# Altium project Analog-PCB_Project.PrjPcb
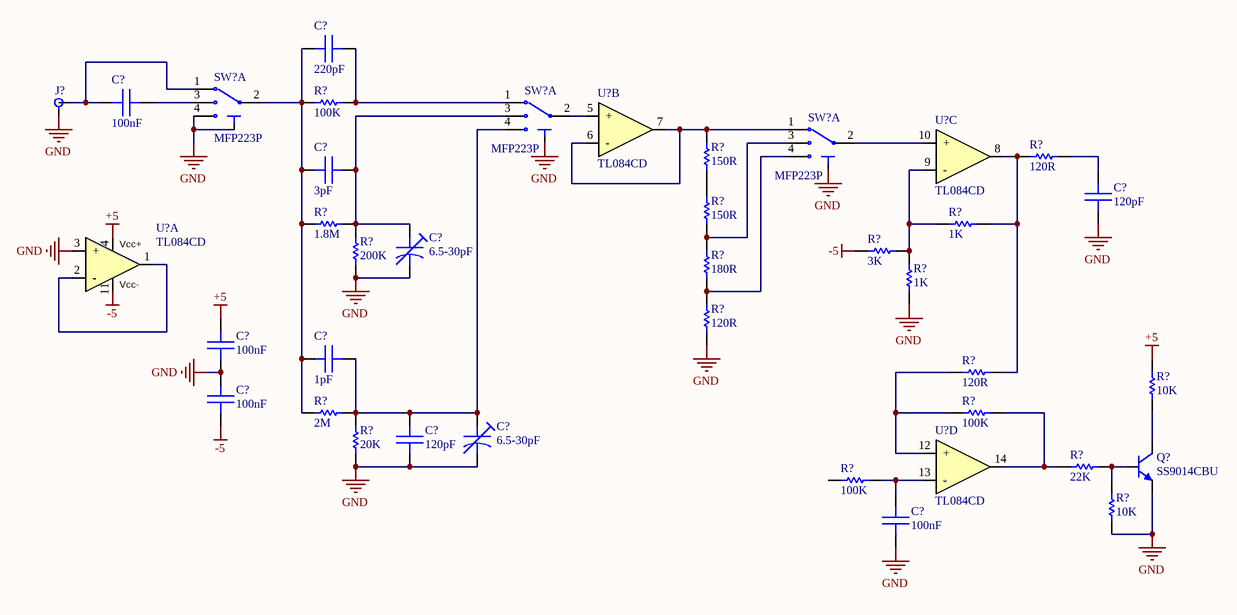
[diagram p0: Sheet.SchDoc]
1 sheet, 39 parts. Net scope: global (net labels, ports and power ports of the same name join across sheets).
Board file: PCB.PcbDoc

## Sheet Sheet.SchDoc: IOElectro LAOS - Analog
size A4; Author: -; CompanyName: IOElectro; DrawnBy: Esmaeill M; Engineer: -; Organization: IOElectro; Address1: Bushehr,Iran; Address2: www.ioelectro.ir; DocumentNumber: 1; Revision: v0.1; SheetNumber: 1; SheetTotal: 1; ProjectNumber: 1013; Note: Analog module

### Parts
(Parts that share a designator on the sheet are numbered #1, #2 ... from top to bottom, then left to right.)
C?#1  220pF  [C-BP-Ceramic-DIP]
C?#2  100nF  [C-BP-Ceramic-DIP]
C?#3  3pF  [C-BP-Ceramic-DIP]
C?#4  120pF  [C-BP-Ceramic-DIP]
C?#5  6.5-30pF  [C-TR-DIP_5mm]
C?#6  100nF  [C-BP-Ceramic-DIP]
C?#7  1pF  [C-BP-Ceramic-DIP]
C?#8  100nF  [C-BP-Ceramic-DIP]
C?#9  120pF  [C-BP-Ceramic-DIP]
C?#10  6.5-30pF  [C-TR-DIP_5mm]
C?#11  100nF  [C-BP-Ceramic-DIP]
J?  Mini BNC  [BNC-Mini_No3D]  (value not drawn)
Q?  SS9014CBU  [TO-92]
R?#1  100K  [R-1/4W-DIP-Blue]
R?#2  120R  [R-1/4W-DIP-Blue]
R?#3  150R  [R-1/4W-DIP-Blue]
R?#4  1.8M  [R-1/4W-DIP-Blue]
R?#5  150R  [R-1/4W-DIP-Blue]
R?#6  1K  [R-1/4W-DIP-Blue]
R?#7  3K  [R-1/4W-DIP-Blue]
R?#8  200K  [R-1/4W-DIP-Blue]
R?#9  1K  [R-1/4W-DIP-Blue]
R?#10  180R  [R-1/4W-DIP-Blue]
R?#11  120R  [R-1/4W-DIP-Blue]
R?#12  120R  [R-1/4W-DIP-Blue]
R?#13  10K  [R-1/4W-DIP-Blue]
R?#14  2M  [R-1/4W-DIP-Blue]
R?#15  100K  [R-1/4W-DIP-Blue]
R?#16  20K  [R-1/4W-DIP-Blue]
R?#17  22K  [R-1/4W-DIP-Blue]
R?#18  100K  [R-1/4W-DIP-Blue]
R?#19  10K  [R-1/4W-DIP-Blue]
SW?#1  MFP223P  [MFP223P]  (part A of 2)
SW?#2  MFP223P  [MFP223P]  (part A of 2)
SW?#3  MFP223P  [MFP223P]  (part A of 2)
U?#1  TL084CD  [SO-14]  (part B of 4)
U?#2  TL084CD  [SO-14]  (part C of 4)
U?#3  TL084CD  [SO-14]  (part A of 4)
U?#4  TL084CD  [SO-14]  (part D of 4)

### Nets
+5: C?#6.1 R?#13.1 U?#3.4(Vcc+)
-5: C?#8.2 R?#7.1 U?#3.11(Vcc-)
GND: C?#4.2 C?#5.K C?#6.2 C?#8.1 C?#9.2 C?#10.K C?#11.2 J?.0 Q?.1(E) R?#8.1 R?#9.2 R?#11.1 R?#16.1 R?#19.2 SW?#1.0 SW?#1.4 SW?#2.0 SW?#3.0 U?#3.3(+)
NetC?#1_1: C?#1.1 R?#1.2 SW?#2.1
NetC?#1_2: C?#1.2 C?#3.2 C?#7.2 R?#1.1 R?#4.1 R?#14.1 SW?#1.2
NetC?#2_1: C?#2.1 SW?#1.3
NetC?#2_2: C?#2.2 J?.1 SW?#1.1
NetC?#3_1: C?#3.1 C?#5.A R?#4.2 R?#8.2 SW?#2.3
NetC?#4_1: C?#4.1 R?#2.1
NetC?#7_1: C?#7.1 C?#9.1 C?#10.A R?#14.2 R?#16.2 SW?#2.4
NetC?#11_1: C?#11.1 R?#18.1 U?#4.13(-)
NetQ?_2: Q?.2(B) R?#17.1 R?#19.1
NetQ?_3: Q?.3(C) R?#13.2
NetR?#2_2: R?#2.2 R?#6.1 R?#12.1 U?#2.8(O)
NetR?#3_1: R?#3.1 R?#5.2
NetR?#3_2: R?#3.2 SW?#3.1 U?#1.6(-) U?#1.7(O)
NetR?#5_1: R?#5.1 R?#10.2 SW?#3.3
NetR?#6_2: R?#6.2 R?#7.2 R?#9.1 U?#2.9(-)
NetR?#10_1: R?#10.1 R?#11.2 SW?#3.4
NetR?#12_2: R?#12.2 R?#15.2 U?#4.12(+)
NetR?#15_1: R?#15.1 R?#17.2 U?#4.14(O)
NetSW?#2_2: SW?#2.2 U?#1.5(+)
NetSW?#3_2: SW?#3.2 U?#2.10(+)
NetU?#3_1: U?#3.1(O) U?#3.2(-)

Not connected (* = marked no-connect by the designer): R?#18 2

### Notes on the sheet
- Title
- Size:
- Date:
- A4
- Project Number:
- Time:
- Revision:
- Sheet
- of
- Drawn By:
- IOElectro
- File:
- Note:

### Library data of the parts
C?#1-C?#4 C?#6-C?#9 C?#11 = CAP: Ceramic Disk Capacitor 50V
C?#5 C?#10 = GKG30015: Trimmer / Variable Capacitors 6.5-30pF 100V 85 DEG; Manufacturer: Sprague Goodman; Q Factor: 300; Supplier 1: Digi-Key; Manufacturer Part Number: GKG30015; RoHS: Yes; Category: Trimmer / Variable Capacitors; Mount: Through Hole; Min Operating Temperature: -25°C; Max Operating Temperature: 85°C; Package Quantity: 500; Voltage Rating: 100V; Packaging: Bulk; Termination: Snap in; Resistor Type: Ceramic; Voltage Rating (DC): 100V; Features: General Purpose; Series: SURFTRIM® GKG; Length: 6mm; Height: 0.2inch; Lead Pitch: 0.24inch; Height - Seated (Max): 0.197inch; RoHS Compliant: Yes; Lead Free: Lead Free; ComponentLink1URL: http://www.mouser.com/catalog/specsheets/659305J.pdf?src-supplier=Mouser; ComponentLink1Description: http://www.mouser.com/catalog/specsheets/659305J.pdf?src-supplier=Mouser; ComponentLink2URL: https://media.digikey.com/pdf/Data%20Sheets/Sprague-Goodman%20PDFs/Ceramic%20Dielectric%20Trimmer%20Caps.pdf?src-supplier=Digi-Key; ComponentLink2Description: https://media.digikey.com/pdf/Data%20Sheets/Sprague-Goodman%20PDFs/Ceramic%20Dielectric%20Trimmer%20Caps.pdf?src-supplier=Digi-Key; ComponentLink3URL: http://www.spraguegoodman.com/pdfs/305.pdf?src-supplier=Digi-Key; ComponentLink3Description: http://www.spraguegoodman.com/pdfs/305.pdf?src-supplier=Digi-Key; Supplier Part Number 1: SG30015-ND
J? = 1274571-1: CONN MINI BNC JACK STR 75OHM PCB; Manufacturer: TE Connectivity; Dielectric Material: PTFE; Body Material: Brass; Body Plating: Nickel; Impedance: 75R; Frequency: 2GHz; Gender: Female; Voltage Rating: 300V; Contact Resistance: 12mR; Mating Cycles: 500; Connector Type: BNC,Jack; Polarity: Normal; Insulation Resistance: 1GR; Number of Positions: 1; PCB Mount Retention: Without; PCB Mounting Orientation: Vertical; Sealable: No (Without); Tail Length: 4mm; Supplier 1: Digi-Key; Manufacturer Part Number: 1274571-1; RoHS: Yes; Category: RF / Coaxial Connectors; Stock 1: 1165; Pricing 1: 1=5/95000, 10=5/40400, 25=5/11840, 50=4/99940, 100=4/76140, 250=4/16624, 500=4/04720, 1000=3/45202, 2500=3/33298 (USD); Mount: Through Hole,PCB,Cable; Contact Material: Bronze; Contact Plating: Gold; Insulation Material: Polytetrafluoroethylene; Min Operating Temperature: -40°C; Max Operating Temperature: 85°C; Orientation: Straight; Termination: Solder; Packaging: Box; Package Quantity: 50; Fastening Type: Bayonet; Voltage Rating (AC): 300V; Max Frequency: 2GHz; Length: 7.54mm; Depth: 7.54mm; Radiation Hardening: No; REACH SVHC: Unknown; ELV: Compliant; Lead Free: Lead Free; ComponentLink1URL: https://datasheet.ciiva.com/11763/0900766b80b27325-11763478.pdf?src-supplier=RSComponents; ComponentLink1Description: https://datasheet.ciiva.com/11763/0900766b80b27325-11763478.pdf?src-supplier=RSComponents; ComponentLink2URL: https://datasheet.ciiva.com/22726/eng-ss-501-585-a-22726636.pdf?src-supplier=Element14; ComponentLink2Description: https://datasheet.ciiva.com/22726/eng-ss-501-585-a-22726636.pdf?src-supplier=Element14; ComponentLink3URL: https://datasheet.ciiva.com/642/c-1274571-b-642904.pdf?src-supplier=Digi-Key; ComponentLink3Description: https://datasheet.ciiva.com/642/c-1274571-b-642904.pdf?src-supplier=Digi-Key; ComponentLink4URL: https://datasheet.ciiva.com/30164/eng-cs-1307191-mini-bnc-connectors-0307-30164565.pdf?src-supplier=Onlinecomponents.com; ComponentLink4Description: https://datasheet.ciiva.com/30164/eng-cs-1307191-mini-bnc-connectors-0307-30164565.pdf?src-supplier=Onlinecomponents.com; ComponentLink5URL: https://datasheet.ciiva.com/16652/eng-cs-1307191-mini-bnc-connectors-0307-16652971.pdf?src-supplier=Avnet+Europe; ComponentLink5Description: https://datasheet.ciiva.com/16652/eng-cs-1307191-mini-bnc-connectors-0307-16652971.pdf?src-supplier=Avnet+Europe; ComponentLink6URL: https://datasheet.ciiva.com/14568/70083431-14568396.pdf?src-supplier=Allied+Electronics; ComponentLink6Description: https://datasheet.ciiva.com/14568/70083431-14568396.pdf?src-supplier=Allied+Electronics; Supplier Part Number 1: A30539-ND
Q? = SS9014CBU: Bipolar (BJT) Single Transistor, NPN, 45 V, 270 MHz, 450 mW, 100 mA, 200; Manufacturer: ON Semiconductor; Max Power Dissipation: 450mW; Frequency: 270MHz; Number of Elements: 1; Collector Emitter Voltage (VCEO): 45V; hFE Min: 60; Max Collector Current: 100mA; Collector Base Voltage (VCBO): 50V; Emitter Base Voltage (VEBO): 5V; Collector Emitter Saturation Voltage: 140mV; Collector-emitter Voltage-Max: 300mV; Supplier 1: Digi-Key; Manufacturer Part Number: SS9014CBU; Category: BJTs; Mount: Through Hole; Case/Package: TO-92; Number of Pins: 3; Weight: 0.179g; Min Operating Temperature: -55°C; Max Operating Temperature: 150°C; Packaging: Bulk; Package Quantity: 1000; Transition Frequency: 270MHz; Polarity: NPN; Power Dissipation: 450mW; Collector Emitter Breakdown Voltage: 45V; Element Configuration: Single; Gain Bandwidth Product: 270MHz; Max Frequency: 270MHz; Voltage Rating (DC): 45V; Current Rating: 100mA; Series: -; Length: 4.58mm; Width: 3.86mm; Height: 4.58mm; Radiation Hardening: No; REACH SVHC: No SVHC; Lead Free: Lead Free; RoHS Compliant: Yes; ComponentLink1URL: https://datasheet.ciiva.com/11207/ss9014-11207537.pdf?src-supplier=Avnet; ComponentLink1Description: https://datasheet.ciiva.com/11207/ss9014-11207537.pdf?src-supplier=Avnet; ComponentLink2URL: https://datasheet.ciiva.com/46415/1863528-46415612.pdf?src-supplier=Element14; ComponentLink2Description: https://datasheet.ciiva.com/46415/1863528-46415612.pdf?src-supplier=Element14; ComponentLink3URL: https://datasheet.ciiva.com/978/ss9014-978974.pdf?src-supplier=Digi-Key; ComponentLink3Description: https://datasheet.ciiva.com/978/ss9014-978974.pdf?src-supplier=Digi-Key; ComponentLink4URL: http://datasheet.octopart.com/SS9014CBU-Fairchild-datasheet-4532.pdf?src-supplier=Newark; ComponentLink4Description: http://datasheet.octopart.com/SS9014CBU-Fairchild-datasheet-4532.pdf?src-supplier=Newark; ComponentLink5URL: http://datasheet.octopart.com/SS9014CBU-ON-Semiconductor-datasheet-85608206.pdf?src-supplier=ON+Semiconductor; ComponentLink5Description: http://datasheet.octopart.com/SS9014CBU-ON-Semiconductor-datasheet-85608206.pdf?src-supplier=ON+Semiconductor; ComponentLink6URL: http://datasheet.octopart.com/SS9014CBU-ON-Semiconductor-datasheet-86698737.pdf?src-supplier=ON+Semiconductor; ComponentLink6Description: http://datasheet.octopart.com/SS9014CBU-ON-Semiconductor-datasheet-86698737.pdf?src-supplier=ON+Semiconductor; ComponentLink7URL: http://datasheet.octopart.com/SS9014CBU-ON-Semiconductor-datasheet-102168068.pdf?src-supplier=ON+Semiconductor; ComponentLink7Description: http://datasheet.octopart.com/SS9014CBU-ON-Semiconductor-datasheet-102168068.pdf?src-supplier=ON+Semiconductor; ComponentLink8URL: http://datasheet.octopart.com/SS9014CBU-ON-Semiconductor-datasheet-86693094.pdf?src-supplier=Element14; ComponentLink8Description: http://datasheet.octopart.com/SS9014CBU-ON-Semiconductor-datasheet-86693094.pdf?src-supplier=Element14; ComponentLink9URL: http://sigma.octopart.com/8329026/technical_drawing/Fairchild-Semiconductor-SS9014CBU.pdf?src-supplier=Fairchild+Semiconductor; ComponentLink9Description: http://sigma.octopart.com/8329026/technical_drawing/Fairchild-Semiconductor-SS9014CBU.pdf?src-supplier=Fairchild+Semiconductor; ComponentLink10URL: http://datasheet.octopart.com/SS9014CBU-Fairchild-Semiconductor-datasheet-67476720.pdf?src-supplier=Newark; ComponentLink10Description: http://datasheet.octopart.com/SS9014CBU-Fairchild-Semiconductor-datasheet-67476720.pdf?src-supplier=Newark; ComponentLink11URL: http://datasheet.octopart.com/SS9014CBU-Fairchild-Semiconductor-datasheet-68342036.pdf?src-supplier=Farnell; ComponentLink11Description: http://datasheet.octopart.com/SS9014CBU-Fairchild-Semiconductor-datasheet-68342036.pdf?src-supplier=Farnell; ComponentLink12URL: http://datasheet.octopart.com/SS9014CBU-Fairchild-Semiconductor-datasheet-68481733.pdf?src-supplier=Newark; ComponentLink12Description: http://datasheet.octopart.com/SS9014CBU-Fairchild-Semiconductor-datasheet-68481733.pdf?src-supplier=Newark; ComponentLink13URL: http://datasheet.octopart.com/SS9014CBU-Fairchild-Semiconductor-datasheet-68661175.pdf?src-supplier=Farnell; ComponentLink13Description: http://datasheet.octopart.com/SS9014CBU-Fairchild-Semiconductor-datasheet-68661175.pdf?src-supplier=Farnell; ComponentLink14URL: http://datasheet.octopart.com/SS9014CBU-Fairchild-Semiconductor-datasheet-78857804.pdf?src-supplier=Farnell; ComponentLink14Description: http://datasheet.octopart.com/SS9014CBU-Fairchild-Semiconductor-datasheet-78857804.pdf?src-supplier=Farnell; ComponentLink15URL: http://datasheet.octopart.com/SS9014CBU-Fairchild-Semiconductor-datasheet-78861914.pdf?src-supplier=Newark; ComponentLink15Description: http://datasheet.octopart.com/SS9014CBU-Fairchild-Semiconductor-datasheet-78861914.pdf?src-supplier=Newark; Supplier Part Number 1: SS9014CBU-ND
R?#1-R?#19 = RES: Resistor DIP 1/4W 1%
SW?#1-SW?#3 = MFP223P: Switch Slide ON ON ON Extended Top Slide 0.35A 30VDC 10000Cycle PC Pins Bracket Mount/Through Hole; Manufacturer: Knitter-Switch; Mechanical Life: 10000Cycles; Actuator Material: Polyoxymethylene; Max Voltage Rating (DC): 30V; Max Current Rating: 200mA; Supplier 1: Arrow Europe; Manufacturer Part Number: MFP223P; RoHS: Yes; Category: Uncategorized; Mount: Through Hole,Brackets; Contact Material: Copper Alloy; Contact Plating: Nickel,Silver; Housing Material: Resin; Min Operating Temperature: -20°C; Max Operating Temperature: 85°C; Termination: PC Pins; Length: 16mm; Depth: 6.5mm; Radiation Hardening: No; Lead Free: Lead Free; RoHS Compliant: Yes; ComponentLink1URL: https://datasheet.ciiva.com/26847/getdatasheetpartid-740636-26847254.pdf?src-supplier=Verical; ComponentLink1Description: https://datasheet.ciiva.com/26847/getdatasheetpartid-740636-26847254.pdf?src-supplier=Verical; Supplier Part Number 1: MFP223P
U?#1-U?#4 = TL084CD: IC OPAMP JFET 4MHZ 14SO; Manufacturer: STMicroelectronics; Operating Supply Voltage: 18V; Max Supply Voltage: 36V; Dual Supply Voltage: 15V; Voltage Gain: 106.02dB; Slew Rate: 16V/µs; Number of Channels: 4; Common Mode Rejection Ratio: 70dB; Min Dual Supply Voltage: 3V; Output Current: 40mA; Nominal Supply Current: 2.5mA; Min Input Voltage: -12V; Input Bias Current: 200pA; Input Offset Voltage (Vos): 10mV; Operating Supply Current: 1.4mA; Power Dissipation: 680mW; Rise Time: 50ns; Amplifier Type: GENERAL PURPOSE; Supplier 1: Digi-Key; Manufacturer Part Number: TL084CD; RoHS: Yes; Category: Amplifiers - Audio; Stock 1: 3951; Pricing 1: 1=0/56000, 10=0/47700, 25=0/44520, 100=0/35620, 250=0/33072, 500=0/27984, 1000=0/21624, 2500=0/21000 (USD); Mount: Surface Mount; Case/Package: SOIC; Number of Pins: 14; Weight: 0.01lb; Min Operating Temperature: 0°C; Max Operating Temperature: 70°C; Package Quantity: 50; Packaging: Rail/Tube; Unity Gain Bandwidth Product: 4MHz; Max Dual Supply Voltage: 18V; Bandwidth: 4MHz; Max Input Voltage: 15V; Number of Circuits: 4; Gain Bandwidth Product: 4MHz; Output Current per Channel: 40mA; Number of Elements: 4; Number of Amplifiers: 4; Supply Current: 2.5mA; Technology: BIFET; Input Offset Voltage-Max: 10mV; Slew Rate-Nom: 16V/µs; Length: 8.75mm; Width: 4mm; Height: 1.65mm; Radiation Hardening: No; REACH SVHC: No SVHC; Lead Free: Lead Free; RoHS Compliant: Yes; ComponentLink1URL: https://datasheet.ciiva.com/15129/getdatasheetpartid-40720-15129705.pdf?src-supplier=Verical; ComponentLink1Description: https://datasheet.ciiva.com/15129/getdatasheetpartid-40720-15129705.pdf?src-supplier=Verical; ComponentLink2URL: https://datasheet.ciiva.com/29306/155629-da-01-en-op-verst-tl084cd-stm-29306876.pdf?src-supplier=Conrad; ComponentLink2Description: https://datasheet.ciiva.com/29306/155629-da-01-en-op-verst-tl084cd-stm-29306876.pdf?src-supplier=Conrad; ComponentLink3URL: https://datasheet.ciiva.com/1796/cd00000493-1796695.pdf?src-supplier=Digi-Key; ComponentLink3Description: https://datasheet.ciiva.com/1796/cd00000493-1796695.pdf?src-supplier=Digi-Key; ComponentLink4URL: https://datasheet.ciiva.com/16385/cd00000493-16385768.pdf?src-supplier=Future+Electronics; ComponentLink4Description: https://datasheet.ciiva.com/16385/cd00000493-16385768.pdf?src-supplier=Future+Electronics; Supplier Part Number 1: 497-TL084CD-ND